# EAGLE schematic EPROM_BANK (EAGLE 7.6.0)
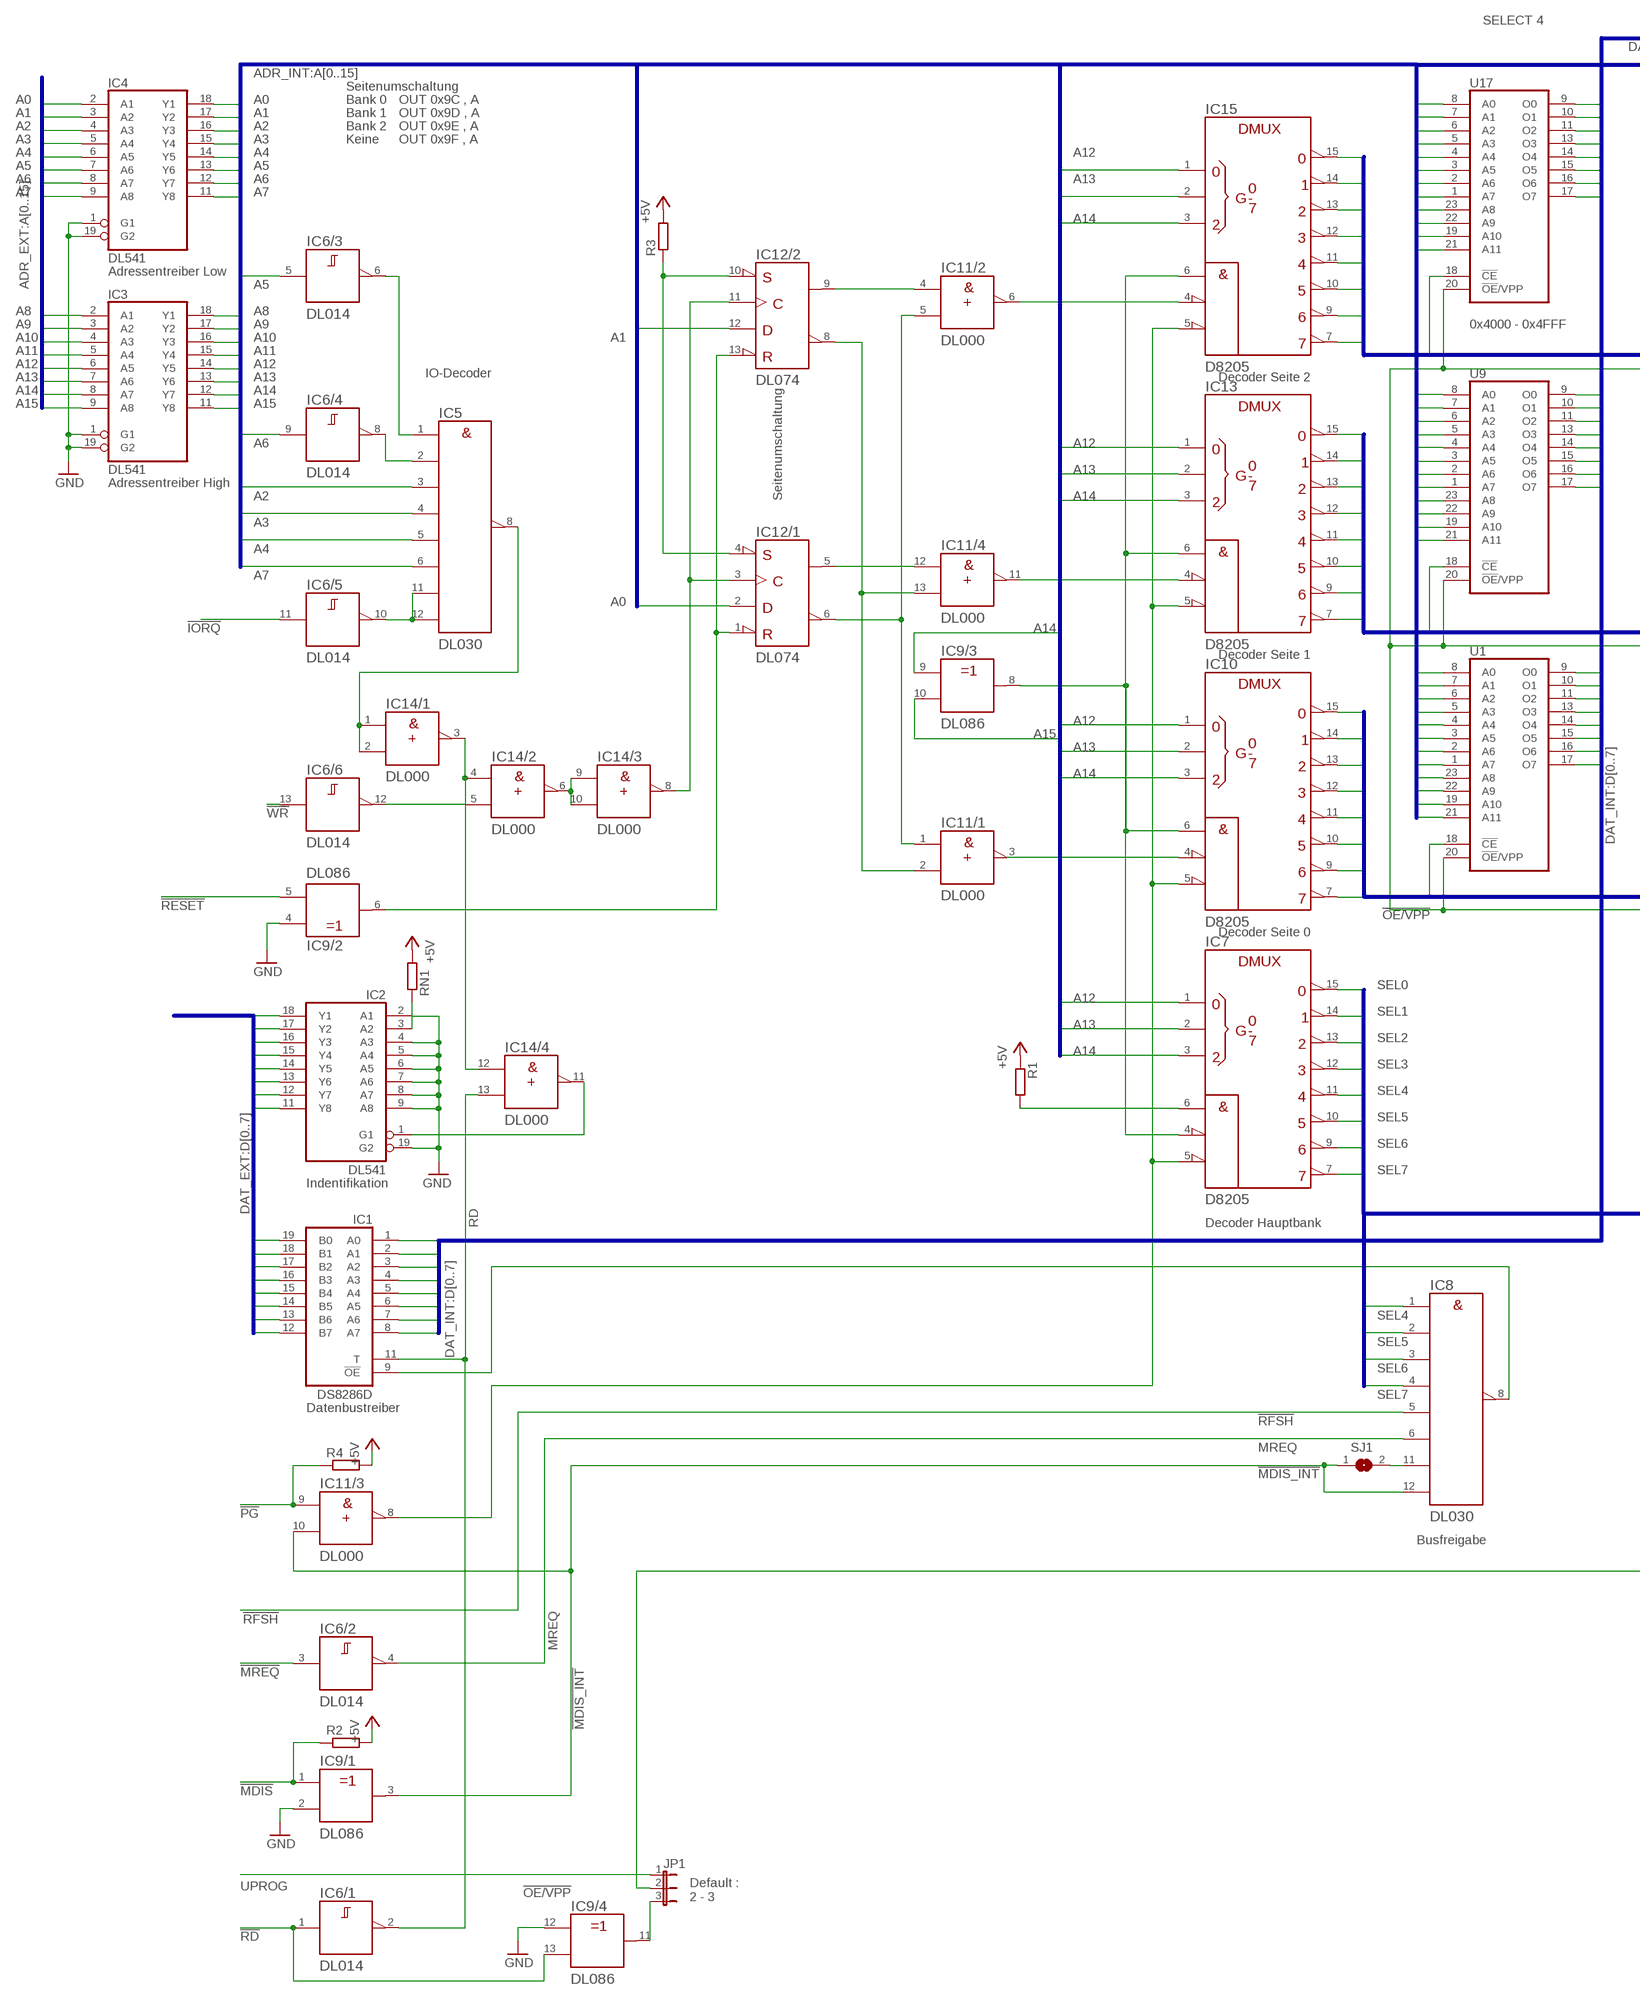
[diagram p0: schematic, sheet 1, part 1 of 2]
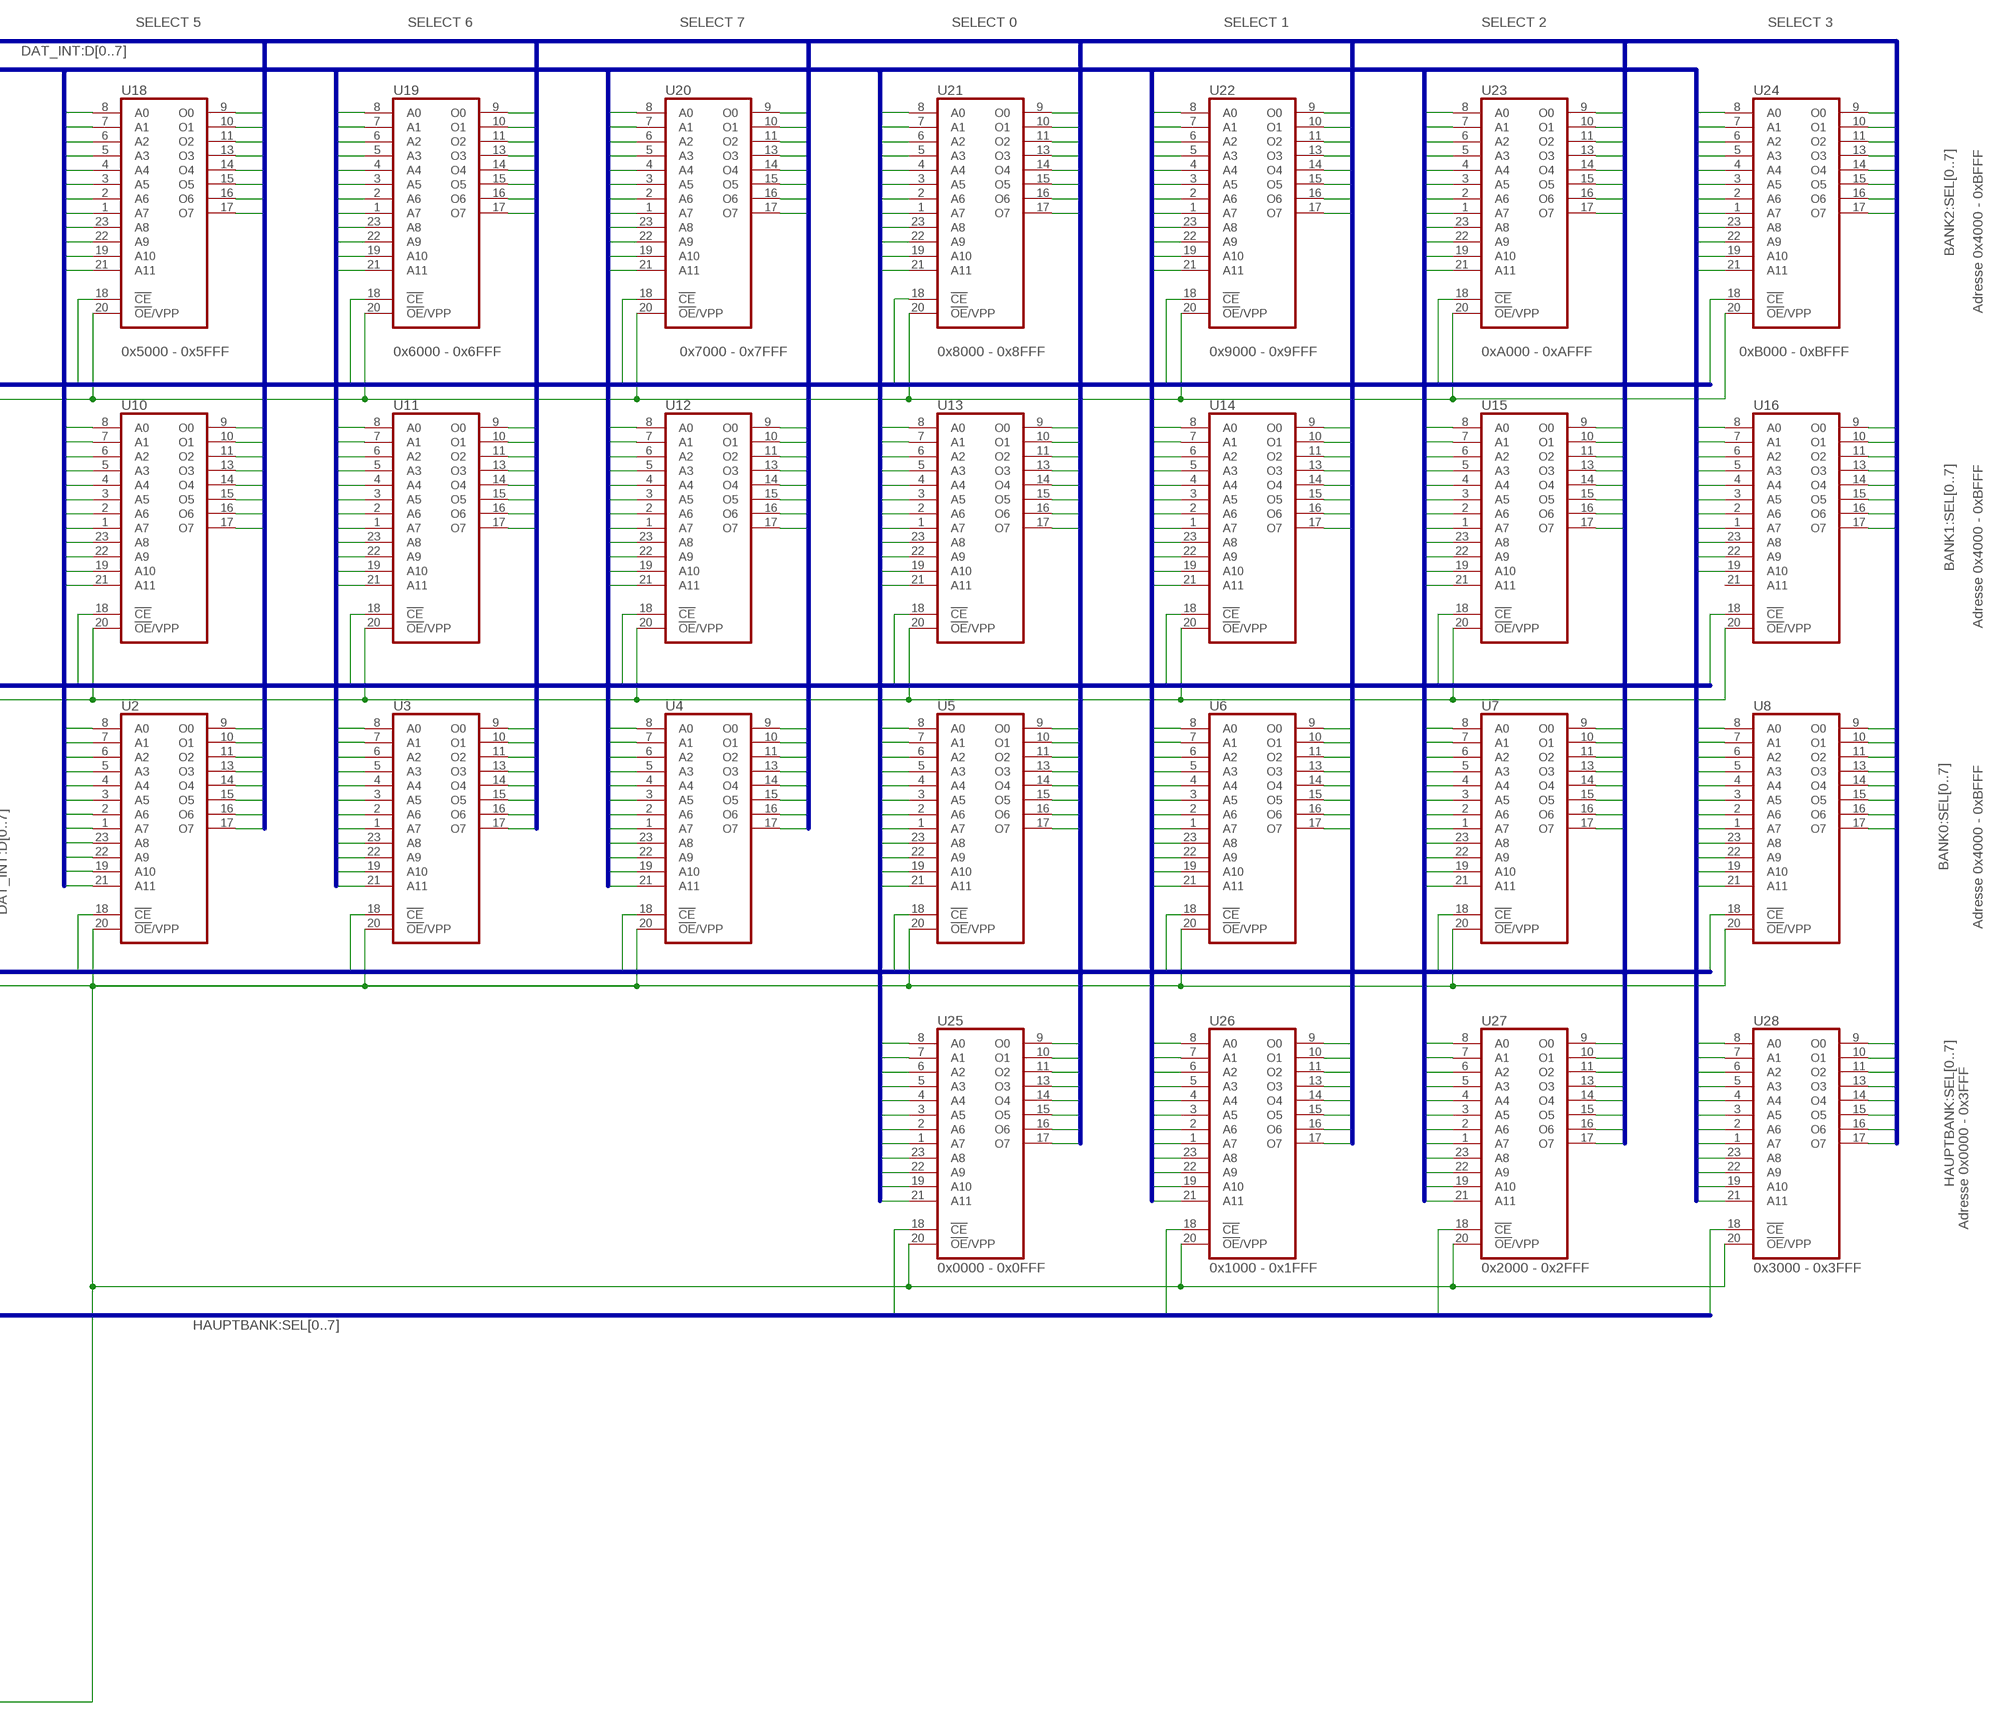
[diagram p1: schematic, sheet 1, part 2 of 2]

## Parts
IC1  DS8286D  8286-A  [DIL20]
IC2  DL541  74LS541N  [DIL20]
IC3  DL541  74LS541N  [DIL20]
IC4  DL541  74LS541N  [DIL20]
IC5  DL030  7430N  [DIL14]
IC6  DL014  7414N  [DIL14]
IC7  D8205  74138N  [DIL16]
IC8  DL030  7430N  [DIL14]
IC9  DL086  7486N  [DIL14]
IC10  D8205  74138N  [DIL16]
IC11  DL000  74LS00N  [DIL14]
IC12  DL074  7474N  [DIL14]
IC13  D8205  74138N  [DIL16]
IC14  DL000  74LS00N  [DIL14]
IC15  D8205  74138N  [DIL16]
JP1  JP2E  [JP2]
R1  R-EU_0207/7  [0207/7]
R2  R-EU_0207/7  [0207/7]
R3  R-EU_0207/7  [0207/7]
R4  R-EU_0207/7  [0207/7]
RN1  R-EU_0207/7  [0207/7]
SJ1  SJ  [SJ]
U1  2732  [DIL24]
U2  2732  [DIL24]
U3  2732  [DIL24]
U4  2732  [DIL24]
U5  2732  [DIL24]
U6  2732  [DIL24]
U7  2732  [DIL24]
U8  2732  [DIL24]
U9  2732  [DIL24]
U10  2732  [DIL24]
U11  2732  [DIL24]
U12  2732  [DIL24]
U13  2732  [DIL24]
U14  2732  [DIL24]
U15  2732  [DIL24]
U16  2732  [DIL24]
U17  2732  [DIL24]
U18  2732  [DIL24]
U19  2732  [DIL24]
U20  2732  [DIL24]
U21  2732  [DIL24]
U22  2732  [DIL24]
U23  2732  [DIL24]
U24  2732  [DIL24]
U25  2732  [DIL24]
U26  2732  [DIL24]
U27  2732  [DIL24]
U28  2732  [DIL24]

## Nets
!A5: IC5.1(A) IC6.6(/3:Y)
!A6: IC5.2(B) IC6.8(/4:Y)
!DAT_DRV_OE: IC1.9(!OE) IC8.8(Y)
!IORQ: IC6.11(/5:A)
!MDIS: IC9.1(/1:A) R2.1
!MDIS_INT: IC8.12(H) IC9.3(/1:Y) IC11.10(/3:B) SJ1.1
!MREQ: IC6.3(/2:A)
!OE/VPP: JP1.2 U1.20(!OE!/VPP) U2.20(!OE!/VPP) U3.20(!OE!/VPP) U4.20(!OE!/VPP) U5.20(!OE!/VPP) U6.20(!OE!/VPP) U7.20(!OE!/VPP) U8.20(!OE!/VPP) U9.20(!OE!/VPP) U10.20(!OE!/VPP) U11.20(!OE!/VPP) U12.20(!OE!/VPP) U13.20(!OE!/VPP) U14.20(!OE!/VPP) U15.20(!OE!/VPP) U16.20(!OE!/VPP) U17.20(!OE!/VPP) U18.20(!OE!/VPP) U19.20(!OE!/VPP) U20.20(!OE!/VPP) U21.20(!OE!/VPP) U22.20(!OE!/VPP) U23.20(!OE!/VPP) U24.20(!OE!/VPP) U25.20(!OE!/VPP) U26.20(!OE!/VPP) U27.20(!OE!/VPP) U28.20(!OE!/VPP)
!PG: IC11.9(/3:A) R4.1
!RD: IC6.1(/1:A) IC9.13(/4:B)
!RESET: IC9.5(/2:B)
!RFSH: IC8.5(E)
!WR: IC6.13(/6:A)
+5V: R1.1 R2.2 R3.2 R4.2 RN1.2
A0: IC4.2(A1) IC4.18(Y1) IC12.2(/1:D) U1.8(A0) U2.8(A0) U3.8(A0) U4.8(A0) U5.8(A0) U6.8(A0) U7.8(A0) U8.8(A0) U9.8(A0) U10.8(A0) U11.8(A0) U12.8(A0) U13.8(A0) U14.8(A0) U15.8(A0) U16.8(A0) U17.8(A0) U18.8(A0) U19.8(A0) U20.8(A0) U21.8(A0) U22.8(A0) U23.8(A0) U24.8(A0) U25.8(A0) U26.8(A0) U27.8(A0) U28.8(A0)
A1: IC4.3(A2) IC4.17(Y2) IC12.12(/2:D) U1.7(A1) U2.7(A1) U3.7(A1) U4.7(A1) U5.7(A1) U6.7(A1) U7.7(A1) U8.7(A1) U9.7(A1) U10.7(A1) U11.7(A1) U12.7(A1) U13.7(A1) U14.7(A1) U15.7(A1) U16.7(A1) U17.7(A1) U18.7(A1) U19.7(A1) U20.7(A1) U21.7(A1) U22.7(A1) U23.7(A1) U24.7(A1) U25.7(A1) U26.7(A1) U27.7(A1) U28.7(A1)
A2: IC4.4(A3) IC4.16(Y3) IC5.3(C) U1.6(A2) U2.6(A2) U3.6(A2) U4.6(A2) U5.6(A2) U6.6(A2) U7.6(A2) U8.6(A2) U9.6(A2) U10.6(A2) U11.6(A2) U12.6(A2) U13.6(A2) U14.6(A2) U15.6(A2) U16.6(A2) U17.6(A2) U18.6(A2) U19.6(A2) U20.6(A2) U21.6(A2) U22.6(A2) U23.6(A2) U24.6(A2) U25.6(A2) U26.6(A2) U27.6(A2) U28.6(A2)
A3: IC4.5(A4) IC4.15(Y4) IC5.4(D) U1.5(A3) U2.5(A3) U3.5(A3) U4.5(A3) U5.5(A3) U6.5(A3) U7.5(A3) U8.5(A3)
A4: IC4.6(A5) IC4.14(Y5) IC5.5(E) U1.4(A4) U2.4(A4) U3.4(A4) U4.4(A4) U5.4(A4) U6.4(A4) U7.4(A4) U8.4(A4) U10.4(A4) U11.4(A4) U12.4(A4) U17.4(A4) U18.4(A4) U19.4(A4) U20.4(A4) U25.4(A4)
A5: IC4.7(A6) IC4.13(Y6) IC6.5(/3:A) U1.3(A5) U2.3(A5) U3.3(A5) U4.3(A5) U5.3(A5) U9.3(A5) U10.3(A5) U11.3(A5) U12.3(A5) U17.3(A5) U18.3(A5) U19.3(A5) U25.3(A5)
A6: IC4.8(A7) IC4.12(Y7) IC6.9(/4:A) U1.2(A6) U2.2(A6) U3.2(A6) U4.2(A6) U5.2(A6) U9.2(A6) U10.2(A6) U11.2(A6) U12.2(A6) U17.2(A6) U18.2(A6) U19.2(A6) U25.2(A6)
A7: IC4.9(A8) IC4.11(Y8) IC5.6(F) U1.1(A7) U2.1(A7) U3.1(A7) U4.1(A7) U5.1(A7) U9.1(A7) U10.1(A7) U11.1(A7) U12.1(A7) U17.1(A7) U18.1(A7) U19.1(A7) U25.1(A7)
A8: IC3.2(A1) IC3.18(Y1) U1.23(A8) U2.23(A8) U3.23(A8) U4.23(A8) U5.23(A8) U9.23(A8) U10.23(A8) U11.23(A8) U12.23(A8) U17.23(A8) U18.23(A8) U19.23(A8) U25.23(A8)
A9: IC3.3(A2) IC3.17(Y2) U1.22(A9) U2.22(A9) U3.22(A9) U4.22(A9) U5.22(A9) U9.22(A9) U10.22(A9) U11.22(A9) U12.22(A9) U17.22(A9) U18.22(A9) U19.22(A9) U25.22(A9)
A10: IC3.4(A3) IC3.16(Y3) U1.19(A10) U2.19(A10) U3.19(A10) U4.19(A10) U5.19(A10) U9.19(A10) U10.19(A10) U11.19(A10) U12.19(A10) U17.19(A10) U18.19(A10) U19.19(A10) U25.19(A10)
A11: IC3.5(A4) IC3.15(Y4) U1.21(A11) U2.21(A11) U3.21(A11) U4.21(A11) U5.21(A11) U9.21(A11) U10.21(A11) U11.21(A11) U12.21(A11) U17.21(A11) U18.21(A11) U19.21(A11) U25.21(A11)
A12: IC3.6(A5) IC3.14(Y5) IC7.1(A) IC10.1(A) IC13.1(A) IC15.1(A)
A13: IC3.7(A6) IC3.13(Y6) IC7.2(B) IC10.2(B) IC13.2(B) IC15.2(B)
A14: IC3.8(A7) IC3.12(Y7) IC7.3(C) IC9.9(/3:A) IC10.3(C) IC13.3(C) IC15.3(C)
A15: IC3.9(A8) IC3.11(Y8) IC9.10(/3:B)
D0: IC1.1(A0) IC1.19(B0) IC2.18(Y1) U1.9(O0) U2.9(O0) U3.9(O0) U4.9(O0) U5.9(O0) U6.9(O0) U7.9(O0) U8.9(O0) U9.9(O0) U10.9(O0) U11.9(O0) U12.9(O0) U13.9(O0) U14.9(O0) U15.9(O0) U16.9(O0) U17.9(O0) U18.9(O0) U19.9(O0) U20.9(O0) U21.9(O0) U22.9(O0) U23.9(O0) U24.9(O0) U25.9(O0) U26.9(O0) U27.9(O0) U28.9(O0)
D1: IC1.2(A1) IC1.18(B1) IC2.17(Y2) U1.10(O1) U2.10(O1) U3.10(O1) U4.10(O1) U5.10(O1) U6.10(O1) U7.10(O1) U8.10(O1) U9.10(O1) U10.10(O1) U11.10(O1) U12.10(O1) U13.10(O1) U14.10(O1) U15.10(O1) U16.10(O1) U17.10(O1) U18.10(O1) U19.10(O1) U20.10(O1) U21.10(O1) U22.10(O1) U23.10(O1) U24.10(O1) U25.10(O1) U26.10(O1) U27.10(O1) U28.10(O1)
D2: IC1.3(A2) IC1.17(B2) IC2.16(Y3) U1.11(O2) U2.11(O2) U3.11(O2) U4.11(O2) U5.11(O2) U6.11(O2) U7.11(O2) U8.11(O2) U9.11(O2) U10.11(O2) U11.11(O2) U12.11(O2) U13.11(O2) U14.11(O2) U15.11(O2) U16.11(O2) U17.11(O2) U18.11(O2) U19.11(O2) U20.11(O2) U21.11(O2) U22.11(O2) U23.11(O2) U24.11(O2) U25.11(O2) U26.11(O2) U27.11(O2) U28.11(O2)
D3: IC1.4(A3) IC1.16(B3) IC2.15(Y4) U1.13(O3) U2.13(O3) U3.13(O3) U4.13(O3) U5.13(O3) U6.13(O3) U7.13(O3) U8.13(O3) U9.13(O3) U10.13(O3) U11.13(O3) U12.13(O3) U13.13(O3) U14.13(O3) U15.13(O3) U16.13(O3) U17.13(O3) U18.13(O3) U19.13(O3) U20.13(O3) U21.13(O3) U22.13(O3) U23.13(O3) U24.13(O3) U25.13(O3) U26.13(O3) U27.13(O3) U28.13(O3)
D4: IC1.5(A4) IC1.15(B4) IC2.14(Y5) U1.14(O4) U2.14(O4) U3.14(O4) U4.14(O4) U5.14(O4) U6.14(O4) U7.14(O4) U8.14(O4) U9.14(O4) U10.14(O4) U11.14(O4) U12.14(O4) U13.14(O4) U14.14(O4) U15.14(O4) U16.14(O4) U17.14(O4) U18.14(O4) U19.14(O4) U20.14(O4) U21.14(O4) U22.14(O4) U23.14(O4) U24.14(O4) U25.14(O4) U26.14(O4) U27.14(O4) U28.14(O4)
D5: IC1.6(A5) IC1.14(B5) IC2.13(Y6) U1.15(O5) U2.15(O5) U3.15(O5) U4.15(O5) U5.15(O5) U6.15(O5) U7.15(O5) U8.15(O5) U9.15(O5) U10.15(O5) U11.15(O5) U12.15(O5) U13.15(O5) U14.15(O5) U15.15(O5) U16.15(O5) U17.15(O5) U18.15(O5) U19.15(O5) U20.15(O5) U21.15(O5) U22.15(O5) U23.15(O5) U24.15(O5) U25.15(O5) U26.15(O5) U27.15(O5) U28.15(O5)
D6: IC1.7(A6) IC1.13(B6) IC2.12(Y7) U1.16(O6) U2.16(O6) U3.16(O6) U4.16(O6) U5.16(O6) U6.16(O6) U7.16(O6) U8.16(O6) U9.16(O6) U10.16(O6) U11.16(O6) U12.16(O6) U13.16(O6) U14.16(O6) U15.16(O6) U16.16(O6) U17.16(O6) U18.16(O6) U19.16(O6) U20.16(O6) U21.16(O6) U22.16(O6) U23.16(O6) U24.16(O6) U25.16(O6) U26.16(O6) U27.16(O6) U28.16(O6)
D7: IC1.8(A7) IC1.12(B7) IC2.11(Y8) U1.17(O7) U2.17(O7) U3.17(O7) U4.17(O7) U5.17(O7) U6.17(O7) U7.17(O7) U8.17(O7) U9.17(O7) U10.17(O7) U11.17(O7) U12.17(O7) U13.17(O7) U14.17(O7) U15.17(O7) U16.17(O7) U17.17(O7) U18.17(O7) U19.17(O7) U20.17(O7) U21.17(O7) U22.17(O7) U23.17(O7) U24.17(O7) U25.17(O7) U26.17(O7) U27.17(O7) U28.17(O7)
GND: IC2.2(A1) IC2.4(A3) IC2.5(A4) IC2.6(A5) IC2.7(A6) IC2.8(A7) IC2.9(A8) IC2.19(G2) IC3.1(G1) IC3.19(G2) IC4.1(G1) IC4.19(G2) IC9.2(/1:B) IC9.4(/2:A) IC9.12(/4:A)
IORQ: IC5.11(G) IC5.12(H) IC6.10(/5:Y)
MREQ: IC6.4(/2:Y) IC8.6(F)
N$1: IC7.4(!G2A) IC9.8(/3:Y) IC10.6(G1) IC13.6(G1) IC15.6(G1)
N$2: IC7.5(!G2B) IC10.5(!G2B) IC11.8(/3:Y) IC13.5(!G2B) IC15.5(!G2B)
N$3: IC11.6(/2:Y) IC15.4(!G2A)
N$4: IC11.11(/4:Y) IC13.4(!G2A)
N$5: IC10.4(!G2A) IC11.3(/1:Y)
N$6: IC11.1(/1:A) IC11.5(/2:B) IC12.6(/1:!Q)
N$7: IC11.2(/1:B) IC11.13(/4:B) IC12.8(/2:!Q)
N$8: IC14.6(/2:Y) IC14.9(/3:A) IC14.10(/3:B)
N$9: IC11.4(/2:A) IC12.9(/2:Q)
N$10: IC11.12(/4:A) IC12.5(/1:Q)
N$11: IC12.4(/1:!PRE) IC12.10(/2:!PRE) R3.1
N$12: IC12.3(/1:CLK) IC12.11(/2:CLK) IC14.8(/3:Y)
N$13: IC9.6(/2:Y) IC12.1(/1:!CLR) IC12.13(/2:!CLR)
N$14: IC2.1(G1) IC14.11(/4:Y)
N$15: IC5.8(Y) IC14.1(/1:A) IC14.2(/1:B)
N$20: IC7.6(G1) R1.2
N$22: IC8.11(G) SJ1.2
N$30: IC14.3(/1:Y) IC14.4(/2:A) IC14.12(/4:A)
N$31: IC9.11(/4:Y) JP1.3
N$32: IC2.3(A2) RN1.1
RD: IC1.11(T) IC6.2(/1:Y) IC14.13(/4:B)
SEL0: IC7.15(Y0) IC10.15(Y0) IC13.15(Y0) IC15.15(Y0) U5.18(!CE) U13.18(!CE) U21.18(!CE) U25.18(!CE)
SEL1: IC7.14(Y1) IC10.14(Y1) IC13.14(Y1) IC15.14(Y1) U6.18(!CE) U14.18(!CE) U22.18(!CE) U26.18(!CE)
SEL2: IC7.13(Y2) IC10.13(Y2) IC13.13(Y2) IC15.13(Y2) U7.18(!CE) U15.18(!CE) U23.18(!CE) U27.18(!CE)
SEL3: IC7.12(Y3) IC10.12(Y3) IC13.12(Y3) IC15.12(Y3) U8.18(!CE) U16.18(!CE) U24.18(!CE) U28.18(!CE)
SEL4: IC7.11(Y4) IC8.1(A) IC10.11(Y4) IC13.11(Y4) IC15.11(Y4) U1.18(!CE) U9.18(!CE) U17.18(!CE)
SEL5: IC7.10(Y5) IC8.2(B) IC10.10(Y5) IC13.10(Y5) IC15.10(Y5) U2.18(!CE) U10.18(!CE) U18.18(!CE)
SEL6: IC7.9(Y6) IC8.3(C) IC10.9(Y6) IC13.9(Y6) IC15.9(Y6) U3.18(!CE) U11.18(!CE) U19.18(!CE)
SEL7: IC7.7(Y7) IC8.4(D) IC10.7(Y7) IC13.7(Y7) IC15.7(Y7) U4.18(!CE) U12.18(!CE) U20.18(!CE)
UPROG: JP1.1
WR: IC6.12(/6:Y) IC14.5(/2:B)
Unconnected: U6.1(A7) U6.2(A6) U6.3(A5) U6.19(A10) U6.21(A11) U6.22(A9) U6.23(A8) U7.1(A7) U7.2(A6) U7.3(A5) U7.19(A10) U7.21(A11) U7.22(A9) U7.23(A8) U8.1(A7) U8.2(A6) U8.3(A5) U8.19(A10) U8.21(A11) U8.22(A9) U8.23(A8) U9.4(A4) U9.5(A3) U10.5(A3) U11.5(A3) U12.5(A3) U13.1(A7) U13.2(A6) U13.3(A5) U13.4(A4) U13.5(A3) U13.19(A10) U13.21(A11) U13.22(A9) U13.23(A8) U14.1(A7) U14.2(A6) U14.3(A5) U14.4(A4) U14.5(A3) U14.19(A10) U14.21(A11) U14.22(A9) U14.23(A8) U15.1(A7) U15.2(A6) U15.3(A5) U15.4(A4) U15.5(A3) U15.19(A10) U15.21(A11) U15.22(A9) U15.23(A8) U16.1(A7) U16.2(A6) U16.3(A5) U16.4(A4) U16.5(A3) U16.19(A10) U16.21(A11) U16.22(A9) U16.23(A8) U17.5(A3) U18.5(A3) U19.5(A3) U20.1(A7) U20.2(A6) U20.3(A5) U20.5(A3) U20.19(A10) U20.21(A11) U20.22(A9) U20.23(A8) U21.1(A7) U21.2(A6) U21.3(A5) U21.4(A4) U21.5(A3) U21.19(A10) U21.21(A11) U21.22(A9) U21.23(A8) U22.1(A7) U22.2(A6) U22.3(A5) U22.4(A4) U22.5(A3) U22.19(A10) U22.21(A11) U22.22(A9) U22.23(A8) U23.1(A7) U23.2(A6) U23.3(A5) U23.4(A4) U23.5(A3) U23.19(A10) U23.21(A11) U23.22(A9) U23.23(A8) U24.1(A7) U24.2(A6) U24.3(A5) U24.4(A4) U24.5(A3) U24.19(A10) U24.21(A11) U24.22(A9) U24.23(A8) U25.5(A3) U26.1(A7) U26.2(A6) U26.3(A5) U26.4(A4) U26.5(A3) U26.19(A10) U26.21(A11) U26.22(A9) U26.23(A8) U27.1(A7) U27.2(A6) U27.3(A5) U27.4(A4) U27.5(A3) U27.19(A10) U27.21(A11) U27.22(A9) U27.23(A8) U28.1(A7) U28.2(A6) U28.3(A5) U28.4(A4) U28.5(A3) U28.19(A10) U28.21(A11) U28.22(A9) U28.23(A8)

## Buses
ADR_INT:A[0..15]
ADR_EXT:A[0..15]
DAT_INT:D[0..7]
HAUPTBANK:SEL[0..7]
BANK0:SEL[0..7]
BANK1:SEL[0..7]
BANK2:SEL[0..7]
DAT_EXT:D[0..7]

## Notes on the sheet
- SELECT 4 | SELECT 5 | SELECT 6 | SELECT 7 | SELECT 0 | SELECT 1 | SELECT 2 | SELECT 3
- Seitenumschaltung
- Bank 0 | OUT 0x9C , A
- Bank 1 | OUT 0x9D , A
- Bank 2 | OUT 0x9E , A
- Keine | OUT 0x9F , A
- Adressentreiber Low
- Adresse 0x4000 - 0xBFFF
- 0x4000 - 0x4FFF | 0x5000 - 0x5FFF | 0x6000 - 0x6FFF | 0x7000 - 0x7FFF | 0x8000 - 0x8FFF | 0x9000 - 0x9FFF | 0xA000 - 0xAFFF | 0xB000 - 0xBFFF
- IO-Decoder
- Decoder Seite 2
- Adressentreiber High
- Seitenumschaltung
- Adresse 0x4000 - 0xBFFF
- Decoder Seite 1
- Adresse 0x4000 - 0xBFFF
- Decoder Seite 0
- Adresse 0x0000 - 0x3FFF
- 0x0000 - 0x0FFF | 0x1000 - 0x1FFF | 0x2000 - 0x2FFF | 0x3000 - 0x3FFF
- Indentifikation
- Decoder Hauptbank
- Datenbustreiber
- Busfreigabe
- Default :
  2 - 3

## Power pins joined to a net without a drawn wire
+UB: IC5.14(+UB) IC6.14(/+UB:+UB) IC7.16(+UB) IC8.14(+UB) IC9.14(/+UB:+UB) IC10.16(+UB) IC11.14(/+UB:+UB) IC12.14(/+UB:+UB) IC13.16(+UB) IC14.14(/+UB:+UB) IC15.16(+UB)
-UB: IC5.7(-UB) IC6.7(/-UB:-UB) IC7.8(-UB) IC8.7(-UB) IC9.7(/-UB:-UB) IC10.8(-UB) IC11.7(/-UB:-UB) IC12.7(/-UB:-UB) IC13.8(-UB) IC14.7(/-UB:-UB) IC15.8(-UB)
GND: IC1.10(GND) IC2.10(GND) IC3.10(GND) IC4.10(GND) U1.12(GND) U2.12(GND) U3.12(GND) U4.12(GND) U5.12(GND) U6.12(GND) U7.12(GND) U8.12(GND) U9.12(GND) U10.12(GND) U11.12(GND) U12.12(GND) U13.12(GND) U14.12(GND) U15.12(GND) U16.12(GND) U17.12(GND) U18.12(GND) U19.12(GND) U20.12(GND) U21.12(GND) U22.12(GND) U23.12(GND) U24.12(GND) U25.12(GND) U26.12(GND) U27.12(GND) U28.12(GND)
VCC: IC1.20(VCC) IC2.20(VCC) IC3.20(VCC) IC4.20(VCC) U1.24(VCC) U2.24(VCC) U3.24(VCC) U4.24(VCC) U5.24(VCC) U6.24(VCC) U7.24(VCC) U8.24(VCC) U9.24(VCC) U10.24(VCC) U11.24(VCC) U12.24(VCC) U13.24(VCC) U14.24(VCC) U15.24(VCC) U16.24(VCC) U17.24(VCC) U18.24(VCC) U19.24(VCC) U20.24(VCC) U21.24(VCC) U22.24(VCC) U23.24(VCC) U24.24(VCC) U25.24(VCC) U26.24(VCC) U27.24(VCC) U28.24(VCC)

## Library data of the parts
IC1 = micro-siemens:8286-A: MICROPROCESSOR/PERIPHERAL DEVICE; OC_FARNELL: unknown; OC_NEWARK: unknown
IC2-IC4 = 74xx-eu:74*541: Octal BUFFER and LINE DRIVER, 3-state
IC5 IC8 = 74ttl-din:74*30: 8-input NAND gate
IC6 = 74ttl-din:74*14: Hex schmitt trigger INVERTER
IC7 IC10 IC13 IC15 = 74ttl-din:74*138: 3-line to 8-line DECODER/DEMULTIPLEXER
IC9 = 74ttl-din:74*86: Quad 2-input EXCLUSIV-OR gate
IC11 IC14 = 74ttl-din:74*00: Quad 2-input NAND gate
IC12 = 74ttl-din:74*74: Dual D type positive edge triggered FLIP FLOP, preset and clear
JP1 = jumper:JP2E: JUMPER
R1-R4 RN1 = rcl:R-EU_: RESISTOR, European symbol
SJ1 = jumper:SJ: SMD solder JUMPER
U1-U28 = memory:2732: MEMORY